# EAGLE design untitled (EAGLE 7.6.0)
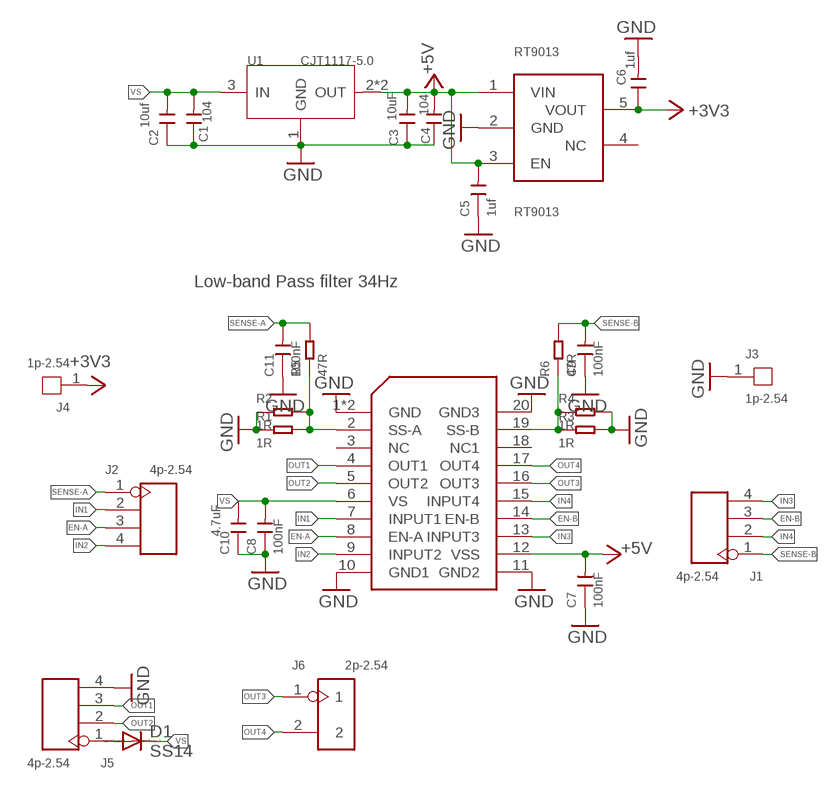
[diagram p0: schematic, sheet 1]

## Parts
C1  104  CAP-(0402)  [C0402]
C2  10uf  CAP-(0402)  [C0402]
C3  10uF  CAP-(0402)  [C0402]
C4  104  CAP-(0402)  [C0402]
C5  1uf  CAP-(0402)  [C0402]
C6  1uf  CAP-(0402)  [C0402]
C7  100nF  CAP-(0402)  [C0402]
C8  100nF  CAP-(0402)  [C0402]
C9  100nF  CAP-(0402)  [C0402]
C10  4.7uF  CAP-(0402)  [C0402]
C11  100nF  CAP-(0402)  [C0402]
D1  SS14  [SMA]
J1  4p-2.54  DIP-BLACK-FEMALE-HEADER-VERT(4P-2.54)  [H4-2.54]
J2  4p-2.54  DIP-BLACK-FEMALE-HEADER-VERT(4P-2.54)  [H4-2.54]
J3  1p-2.54  DIP-BLACK-ROUND-FEMALE-HEADER-VERT(1P-2.54)  [1P-65/35MIL]
J4  1p-2.54  DIP-BLACK-ROUND-FEMALE-HEADER-VERT(1P-2.54)  [1P-65/35MIL]
J5  4p-2.54  DIP-BLACK-FEMALE-HEADER-VERT(4P-2.54)  [H4-2.54]
J6  2p-2.54  DIP-BLACK-ROUND-FEMALE-HEADER-VERT(2P-2.54)  [H2-2.54]
P-1  L298P  [POWERSO-20]
R1  1R  RES-(0402)  [R0402]
R2  1R  RES-(0402)  [R0402]
R3  1R  RES-(0402)  [R0402]
R4  1R  RES-(0402)  [R0402]
R5  47R  RES-(0402)  [R0402]
R6  47R  RES-(0402)  [R0402]
RT9013  RT9013  [SOT23-5]
U1  CJT1117-5.0  PMIC-CJT1117-3.3(SOT223)  [SOT-223]

## Nets
+3V3: C6.1 J4.1 RT9013.5(VOUT)
+5V: C3.2 C4.2 C5.2 C7.2 P-1.12(VSS) RT9013.1(VIN) RT9013.3(EN) U1.2(OUT) U1.TER(OUT)
EN-A: J2.3 P-1.8(EN-A)
EN-B: J1.3 P-1.14(EN-B)
GND: C1.1 C2.1 C3.1 C4.1 C5.1 C6.2 C7.1 C8.1 C9.1 C10.1 C11.1 J3.1 J5.4 P-1.1(GND) P-1.10(GND1) P-1.11(GND2) P-1.20(GND3) P-1.GND R1.1 R2.1 R3.2 R4.2 RT9013.2(GND) U1.1(GND)
IN1: J2.2 P-1.7(INPUT1)
IN2: J2.4 P-1.9(INPUT2)
IN3: J1.4 P-1.13(INPUT3)
IN4: J1.2 P-1.15(INPUT4)
N$1: D1.A J5.1
N$2: P-1.2(SS-A) R1.2 R2.2 R5.1
N$3: P-1.19(SS-B) R3.1 R4.1 R6.1
OUT1: J5.3 P-1.4(OUT1)
OUT2: J5.2 P-1.5(OUT2)
OUT3: J6.1 P-1.16(OUT3)
OUT4: J6.2 P-1.17(OUT4)
SENSE-A: C11.2 J2.1 R5.2
SENSE-B: C9.2 J1.1 R6.2
VS: C1.2 C2.2 C8.2 C10.2 D1.C P-1.6(VS) U1.3(IN)
Unconnected: P-1.3(NC) P-1.18(NC1) RT9013.4(NC)

## Notes on the sheet
- Low-band Pass filter 34Hz

## Library data of the parts
C1-C11 = 1-LDA_Board:CAP-(0402): 302010041; MPN: GRM1555C1H150JA01D; VALUE: 15pf
D1 = 1-LDA_Board:SS14
J1 J2 J5 = Seeed-OPL-Connector:DIP-BLACK-FEMALE-HEADER-VERT(4P-2.54): 320030017; MPN: F185-1104A1BSYA1
J3 J4 = Seeed-OPL-Connector:DIP-BLACK-ROUND-FEMALE-HEADER-VERT(1P-2.54): 320030026; MPN: RF130-1013BBS0741
J6 = Seeed-OPL-Connector:DIP-BLACK-ROUND-FEMALE-HEADER-VERT(2P-2.54): 320030050; MPN: RF130-1023ABS0741
P-1 = 1-LDA_Board:L298P
R1-R6 = 1-LDA_Board:RES-(0402): 301010000; MPN: RC0402JR-070RL; VALUE: 0R
RT9013 = 1-LDA_Board:RT9013
U1 = 1-LDA_Board:PMIC-CJT1117-3.3(SOT223): 310030097; MPN: CJT1117-3.3; VALUE: CJT1117-3.3-SOT223

## Board
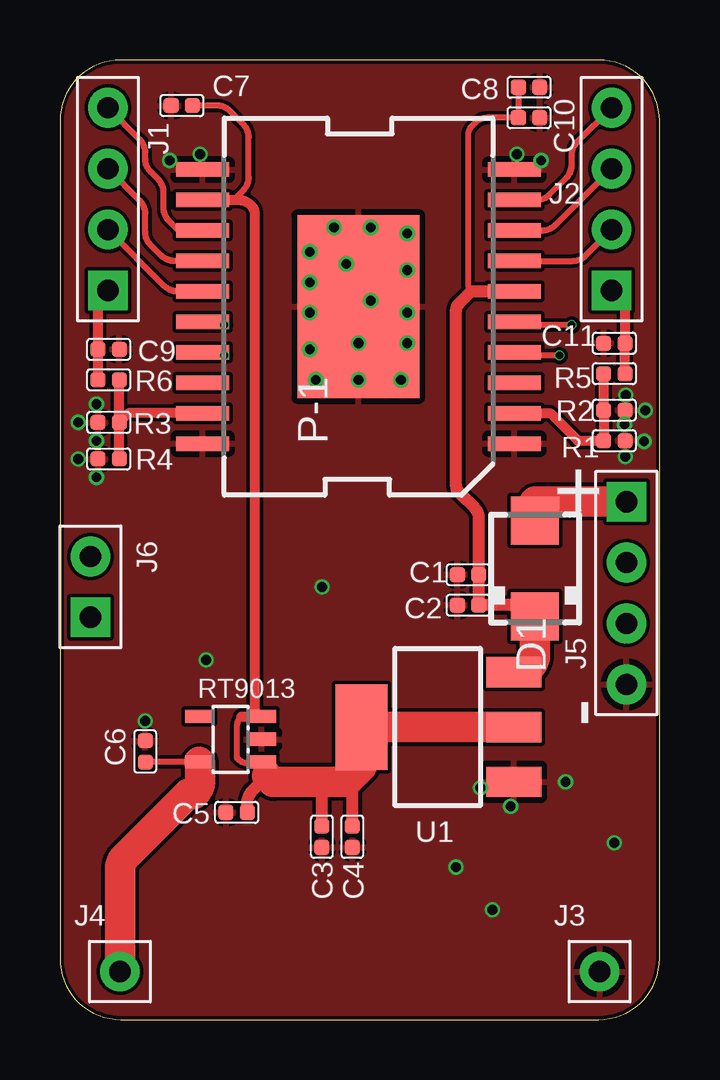
[diagram p1: board, top side]
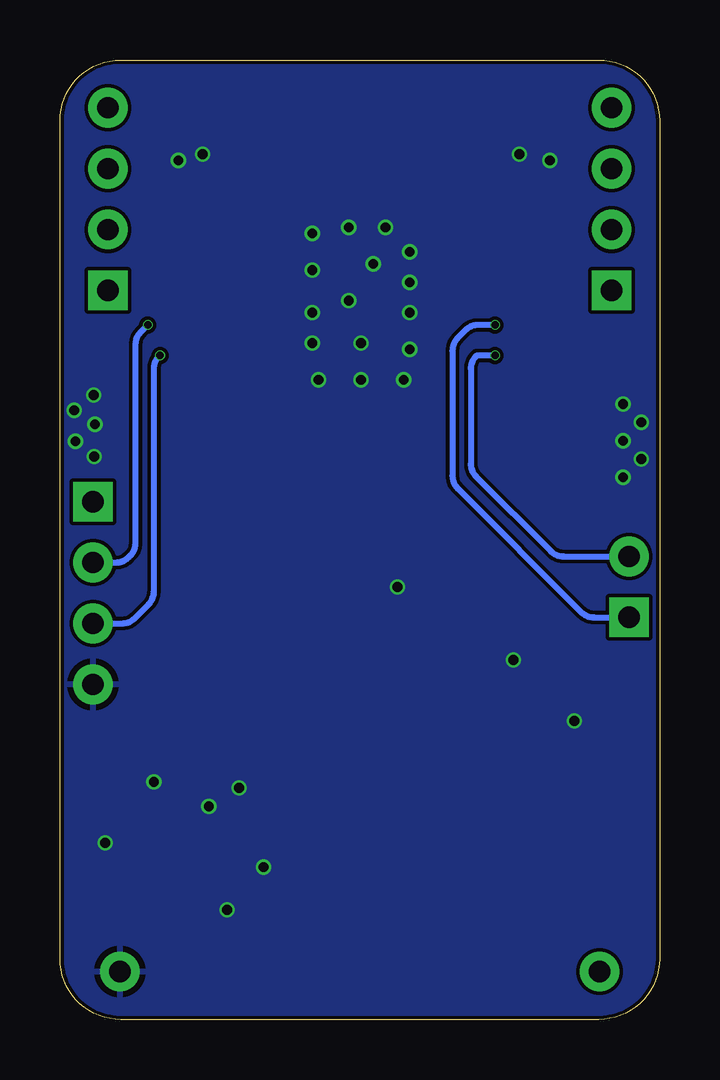
[diagram p2: board, bottom side, seen from below]

Size 25 x 40 mm. Coordinates in mm from the lower left corner, seen from the top.
Outline: 22.46,40 2.54,40 arc90 0,37.46 0,2.54 arc90 2.54,0 22.46,0 arc90 25,2.54 25,37.46 arc90 22.46,40
Copper layers (1*16): Top 0.035mm / dielectric 1.5mm / Bottom 0.035mm
Design rules "default *": minimum track width 6mil, minimum drill 12mil, track to track 6mil, track to pad 6mil, pad to pad 6mil, via to via 6mil, smd to smd 6mil, copper to edge 6mil, drill to drill 8mil, minimum pad ring 10mil, minimum via ring 2mil, stop-mask expansion 4mil, vias tented up to drill 12mil, thermal gap 10mil

### Footprints (pad centres in the part's own frame; a part is rotated, then mirrored left to right if it is on the bottom)
C0402 = smd 0.635 x 0.635: 1 0,0.445; 2 0,-0.445
SMA = smd 2 x 2: A 2,0; C -2,0
H4-2.54 = drill 0.889 pad 1.651 square: 1 0,3.81 | drill 0.889 pad 1.651: 2 0,1.27; 3 0,-1.27; 4 0,-3.81
1P-65/35MIL = drill 0.889 pad 1.651: 1 0,0
H2-2.54 = drill 0.889 pad 1.651 square: 1 0,1.27 | drill 0.889 pad 1.651: 2 0,-1.27
POWERSO-20 = smd 0.6 x 2.2: 1 -5.715,-6.5; 2 -4.445,-6.5; 3 -3.175,-6.5; 4 -1.905,-6.5; 5 -0.635,-6.5; 6 0.635,-6.5; 7 1.905,-6.5; 8 3.175,-6.5; 9 4.445,-6.5; 10 5.715,-6.5; 11 5.715,6.5; 12 4.445,6.5; 13 3.175,6.5; 14 1.905,6.5; 15 0.635,6.5; 16 -0.635,6.5; 17 -1.905,6.5; 18 -3.175,6.5; 19 -4.445,6.5; 20 -5.715,6.5 | smd 7.62 x 5.08: GND 0,0
R0402 = smd 0.635 x 0.635: 1 0,0.445; 2 0,-0.445
SOT23-5 = smd 0.55 x 1.2: 1 -0.95,-1.3; 2 0,-1.3; 3 0.95,-1.3; 4 0.95,1.3; 5 -0.95,1.3
SOT-223 = smd 1.27 x 2.286: 1 -2.286,-3.175; 2 0,-3.175; 3 2.286,-3.175 | smd 3.556 x 2.159: TER 0,3.175

### Placement (x,y rotation side)
C1  17.02,18.54 90 top
C2  17.02,17.27 90 top
C3  10.92,7.62 180 top
C4  12.19,7.62 180 top
C5  7.37,8.64 90 top
C6  3.56,11.18 180 top
C7  5.08,38.1 90 top
C8  19.56,38.86 270 top
C9  2.03,27.94 270 top
C10  19.56,37.59 270 top
C11  23.11,28.19 90 top
D1  19.81,18.8 90 top
J1  2,34.2 180 top
J2  23,34.2 180 top
J3  22.5,2 0 top
J4  2.5,2 0 top
J5  23.62,17.78 0 top
J6  1.27,18.03 180 top
P-1  12.45,29.72 90 top
R1  23.11,24.13 270 top
R2  23.11,25.4 270 top
R3  2.03,24.89 270 top
R4  2.03,23.37 270 top
R5  23.11,26.92 90 top
R6  2.03,26.67 270 top
RT9013  7.11,11.68 90 top
U1  15.75,12.19 90 top

### Tracks (layer width: path | path; a pad name or v marks a point on that pad's centre or on a via)
+3V3
  Top 0.254: RT9013.5 C6.1
  Top 1.27: J4.1 2.5,6.25 arc-45 2.72,6.79 5.33,9.4 5.59,9.4 5.62,9.43 arc45 5.84,9.97 5.84,10.7 RT9013.5
+5V
  Top 0.254: P-1.12 6.86,34.16 7.24,34.16 7.65,34.58 arc45 7.87,35.11 7.87,36.77 arc45 7.65,37.31 7.08,37.88 arc45 6.54,38.1 C7.2 | 8.64,10.16 8.64,10.51 RT9013.1 8.35,10.67 7.94,10.67 arc-45 7.4,10.89 arc-45 7.37,10.97 7.37,12.18 arc-45 7.55,12.63 RT9013.3
  Top 0.406: 7.55,12.63 8.13,12.63 8.13,33.56 arc45 7.97,33.94 arc45 7.43,34.16 6.86,34.16
  Top 0.508: C4.2 12.19,9.34 arc45 11.97,9.88 11.94,9.91 | C3.2 10.92,9.91 | C5.2 7.81,9.02 arc-45 8.03,9.56 8.64,10.16
  Top 1.27: 8.64,10.16 8.89,9.91 10.92,9.91 11.94,9.91 12.57,10.54 U1.TER U1.2
EN-A
  Top 0.254: P-1.8 20.11,32.89 arc45 20.65,33.12 J2.3
EN-B
  Top 0.254: P-1.14 4.76,31.62 arc-45 4.22,31.85 3.78,32.29 arc-45 3.56,32.83 3.56,33.6 arc45 3.33,34.14 J1.3
GND  (via drill 0.41 pad 0.64)
  other vias: 11.94,31.5 11.43,33.02 12.95,29.97 12.95,33.02 14.48,32.77 10.41,32 10.41,30.73 12.45,28.19 10.41,29.46 10.41,27.94 14.48,28.19 14.48,31.24 10.67,26.67 12.45,26.67 14.22,26.67 14.48,29.46 18.03,4.57 23.11,7.37 16.51,6.35 21.08,9.91 18.8,8.89 17.53,9.65 3.56,12.45 10.92,18.03 6.1,14.99 5.84,36.07 19.05,36.07 4.57,35.81 20.07,35.81 1.52,24.13 0.76,24.89 1.52,25.65 0.76,23.37 1.52,22.61 23.55,24.82 24.41,25.4 24.36,24.1 23.6,26.04 23.57,23.47
  pour Top: -2.79,42.42 28.45,42.42 28.45,-6.35 -2.79,-6.35
  pour Bottom: -2.03,42.93 26.92,42.93 26.92,-11.43 -2.03,-11.43
IN1
  Top 0.254: P-1.7 21.38,31.62 arc45 21.92,31.85 J2.2
IN2
  Top 0.254: P-1.9 19.88,34.16 arc45 20.42,34.39 21.11,35.08 arc45 21.34,35.62 21.34,36.03 arc-45 21.56,36.57 J2.4
IN3
  Top 0.254: P-1.13 4.95,32.89 4.54,33.3 arc-45 4.32,33.84 4.32,34.48 arc45 4.09,35.02 3.78,35.34 arc-45 3.56,35.88 3.56,36.14 arc45 3.33,36.68 J1.4
IN4
  Top 0.254: P-1.15 4.89,30.35 arc-45 4.35,30.58 J1.2
N$1
  Top 1.27: J5.1 19.81,21.59 D1.A
N$2
  Top 0.406: R5.1 R2.2 R1.2 21.59,24.13 20.45,25.27 P-1.2
N$3
  Top 0.406: R4.1 R3.1 | P-1.19 2.86,25.27 R3.1 | R3.1 R6.1
OUT1  (via drill 0.3)
  Top 0.254: v20.83,27.69 19.07,27.69 P-1.4
  Bottom 0.254: J5.3 22.41,16.51 arc-45 21.88,16.73 21.3,17.3 arc-45 21.08,17.84 21.08,27.12 arc45 20.86,27.66 v20.83,27.69
OUT2  (via drill 0.3)
  Top 0.254: v21.34,28.96 19.07,28.96 P-1.5
  Bottom 0.254: J5.2 22.67,19.05 arc-45 22.13,19.27 22.07,19.34 arc-45 21.84,19.87 21.84,28.13 arc45 21.62,28.67 v21.34,28.96
OUT3  (via drill 0.3)
  Top 0.254: P-1.16 6.73,29.08 v6.86,28.96
  Bottom 0.254: v6.86,28.96 7.56,28.96 arc-45 8.1,28.73 8.41,28.42 arc-45 8.64,27.88 8.64,22.67 arc-45 8.41,22.13 3.27,16.99 arc-45 2.73,16.76 J6.1
OUT4  (via drill 0.3)
  Top 0.254: P-1.17 6.73,27.81 v6.86,27.69
  Bottom 0.254: v6.86,27.69 7.58,27.69 arc-45 7.65,27.66 arc-45 7.87,27.12 7.87,23.18 arc-45 7.65,22.64 4.54,19.53 arc-45 4,19.3 J6.2
SENSE-A
  Top 0.406: R5.2 C11.2 23.56,29.83 J2.1
SENSE-B
  Top 0.406: R6.2 C9.2 1.59,29.98 J1.1
VS
  Top 0.254: 17.14,30.35 arc-45 17.02,30.66 17.02,36.87 arc-45 17.17,37.23 17.3,37.37 arc-45 17.84,37.59 C10.2 C8.2
  Top 0.508: P-1.6 17.14,30.35 16.66,29.87 arc45 16.51,29.51 16.51,22.31 arc45 16.66,21.95 17.31,21.29 arc-45 17.46,20.93 C1.2 C2.2 19.34,17.27 D1.C
  Top 1.27: D1.C 19.81,15.24 arc-90 19.05,14.48 U1.3

### Text on the board
tPlace: + | -